# Altium project AMC_FMC_Carrier v4.PrjPcb (part 14 of 18)

## Sheet Clock_WR.SchDoc: AMC FMC Carrier v4
size 420 x 297 mm; CompanyName: WUT; Organization: WUT ISE; Address1: Warsaw Univeristy of Technology; Address2: Nowowiejska 15/19 00-665 Warsaw; Address3: t.przywozki@gmail.com; Revision: 1; SheetNumber: 23; SheetTotal: 29; Project: AMC FMC Carrier v4; ModifiedBy: -; CheckedDate: -; Title2: WR Clocks; DivGrp: ISE; Designer: T. Przywozki; ModifiedDate: -; ProjectName: ADC/DAC MEZZANINE
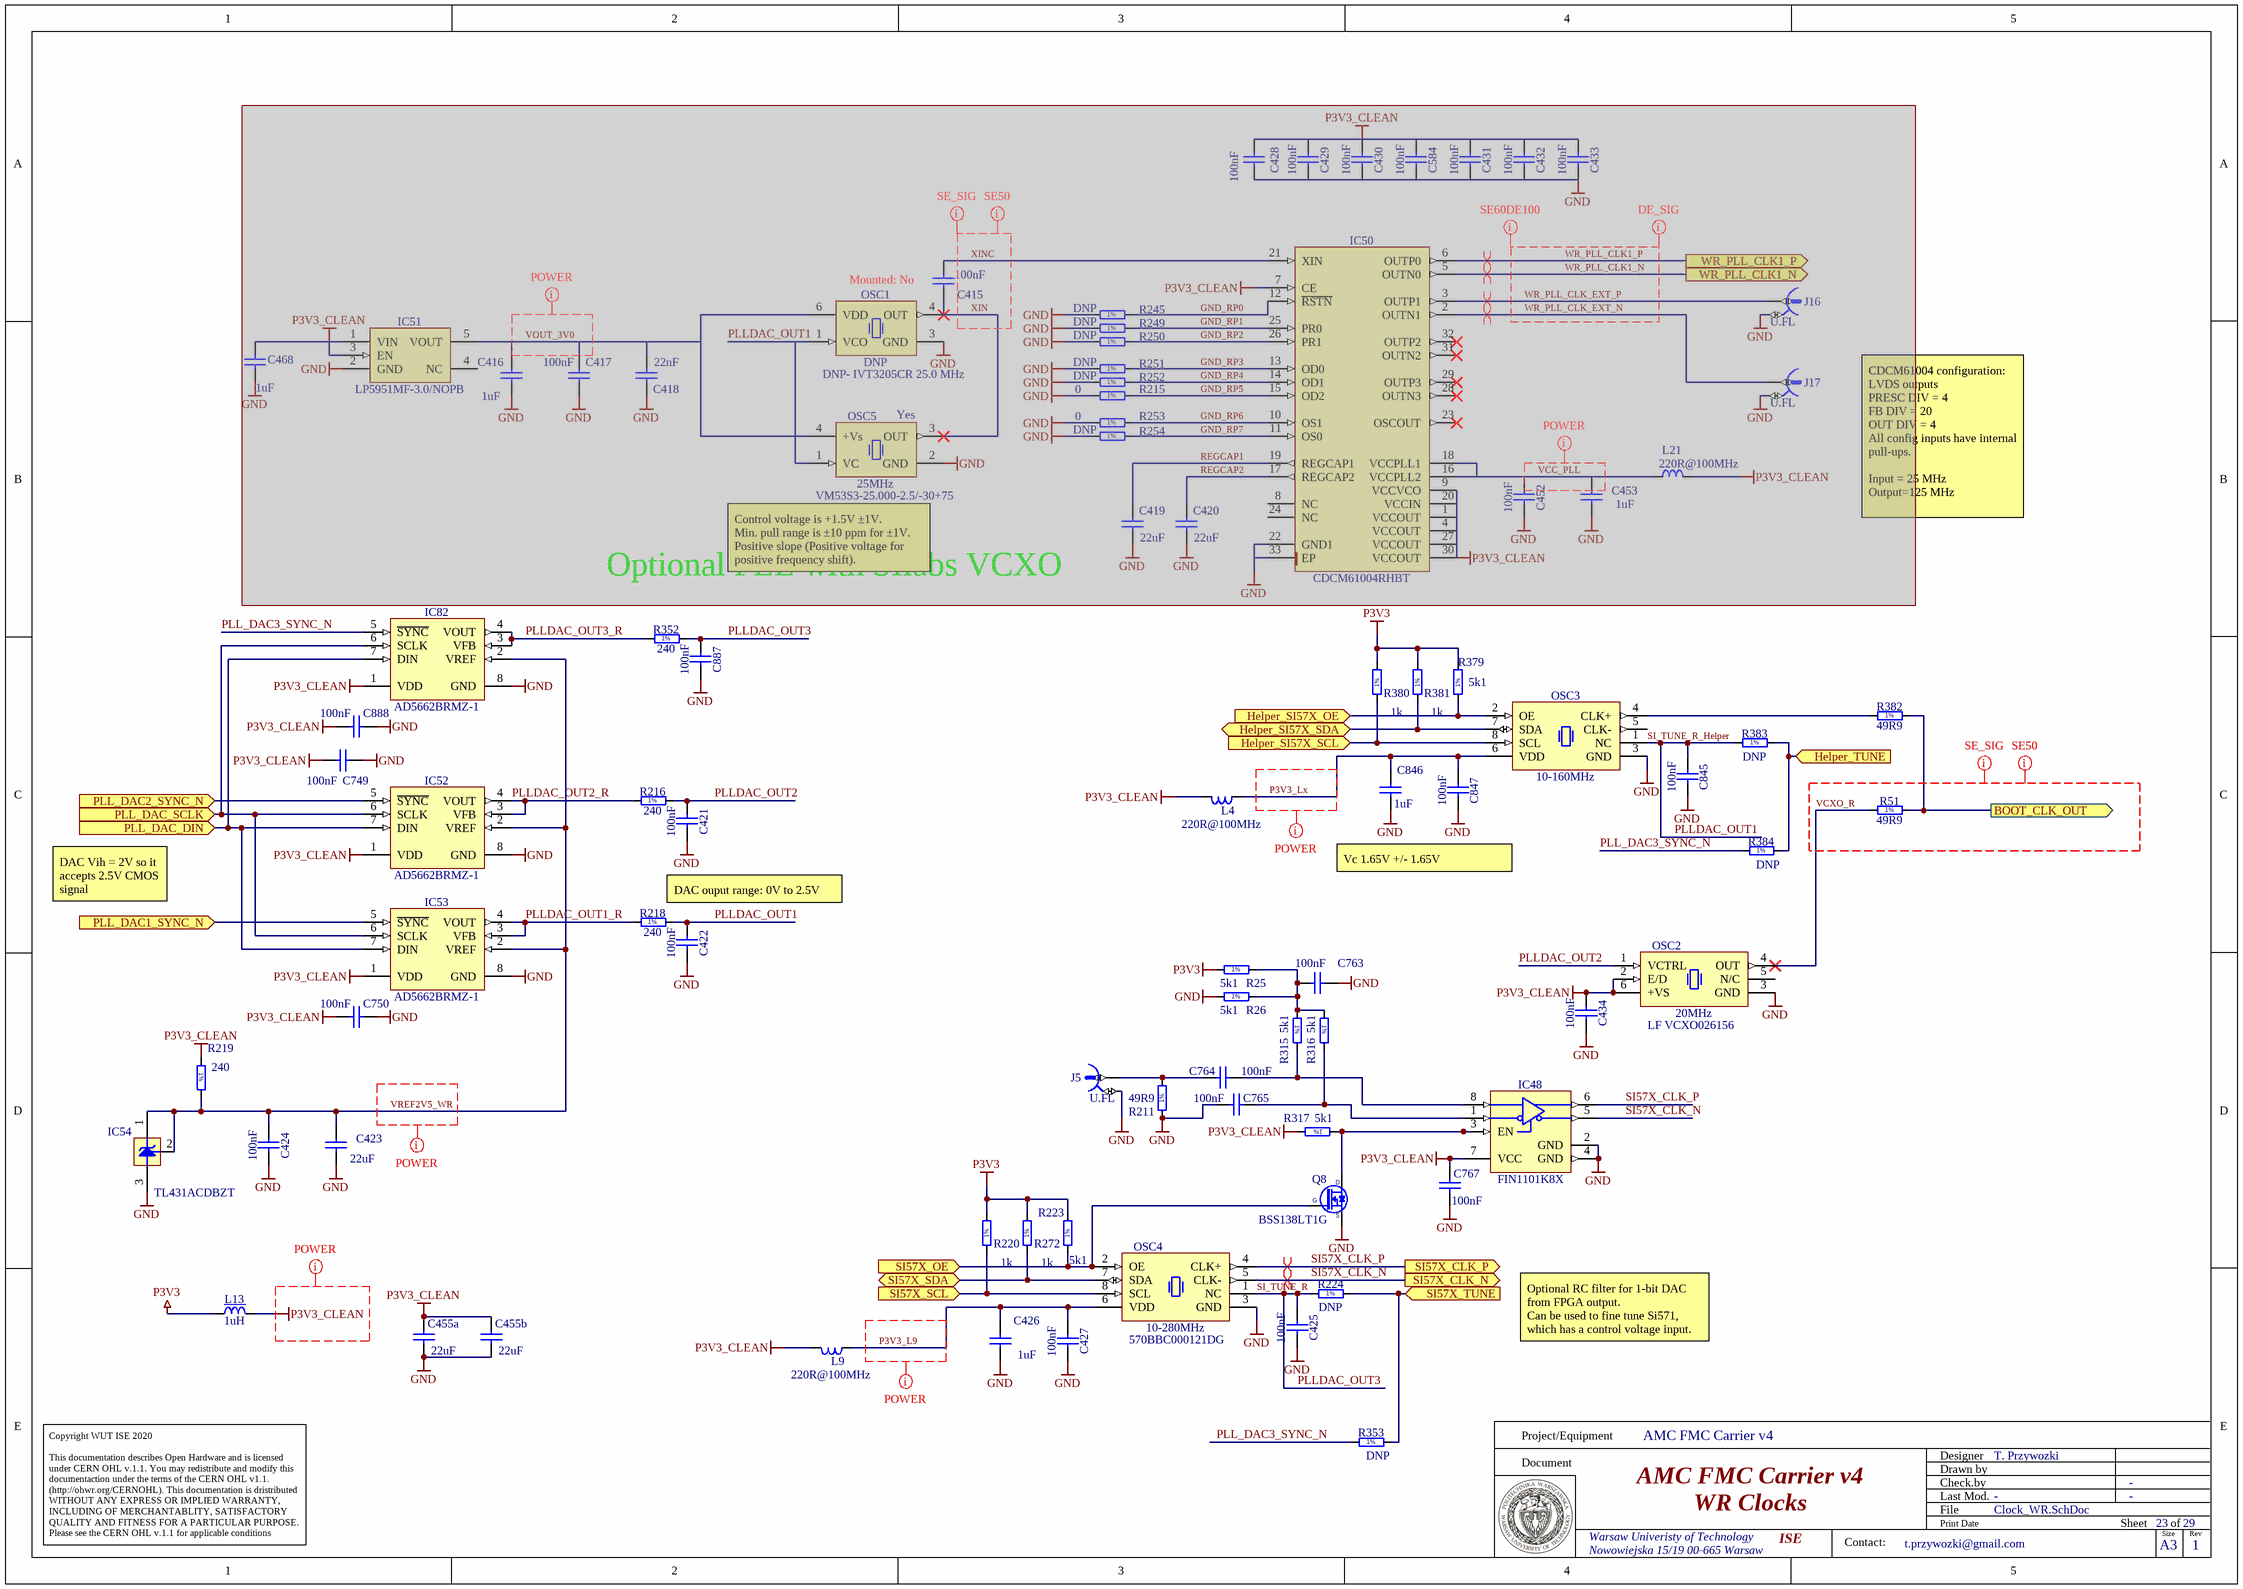
[diagram p24: Clock_WR.SchDoc]

### Parts
(Parts that share a designator on the sheet are numbered #1, #2 ... from top to bottom, then left to right.)
C415#2  100nF  [CAPC0603X33N]  (masked out: inside a compile mask, not in the netlist)
C416#2  1uF  [CAPC1608X87N]  (masked out: inside a compile mask, not in the netlist)
C417#2  100nF  [CAPC0603X33N]  (masked out: inside a compile mask, not in the netlist)
C418#2  22nF  [CAPC0603X33N]  (masked out: inside a compile mask, not in the netlist)
C419#2  22uF  [CAPC3216X180N]  (masked out: inside a compile mask, not in the netlist)
C420  22uF  [CAPC3216X180N]  (masked out: inside a compile mask, not in the netlist)
C421  100nF  [CAPC0603X33N]
C422  100nF  [CAPC0603X33N]
C423  22uF  [CAPC3216X180N]
C424  100nF  [CAPC0603X33N]
C425  100nF  [CAPC0603X33N]
C426  1uF  [CAPC1608X87N]
C427  100nF  [CAPC0603X33N]
C428  100nF  [CAPC0603X33N]  (masked out: inside a compile mask, not in the netlist)
C429  100nF  [CAPC0603X33N]  (masked out: inside a compile mask, not in the netlist)
C430  100nF  [CAPC0603X33N]  (masked out: inside a compile mask, not in the netlist)
C431  100nF  [CAPC0603X33N]  (masked out: inside a compile mask, not in the netlist)
C432  100nF  [CAPC0603X33N]  (masked out: inside a compile mask, not in the netlist)
C433#2  100nF  [CAPC0603X33N]  (masked out: inside a compile mask, not in the netlist)
C434  100nF  [CAPC0603X33N]
C452#2  100nF  [CAPC0603X33N]  (masked out: inside a compile mask, not in the netlist)
C453#1  1uF  [CAPC1608X87N]  (masked out: inside a compile mask, not in the netlist)
C455a  22uF  [CAPC3216X180N]
C455b  22uF  [CAPC3216X180N]
C468  1uF  [CAPC1608X87N]  (masked out: inside a compile mask, not in the netlist)
C584  100nF  [CAPC0603X33N]  (masked out: inside a compile mask, not in the netlist)
C749  100nF  [CAPC0603X33N]
C750  100nF  [CAPC0603X33N]
C763  100nF  [CAPC0603X33N]
C764  100nF  [CAPC0603X33N]
C765  100nF  [CAPC0603X33N]
C767  100nF  [CAPC0603X33N]
C845  100nF  [CAPC0603X33N]
C846  1uF  [CAPC1608X87N]
C847  100nF  [CAPC0603X33N]
C887  100nF  [CAPC0603X33N]
C888  100nF  [CAPC0603X33N]
IC48  FIN1101K8X  [SOP50P310X90-8N]
IC50#2  CDCM61004RHBT  [QFN50P500X500X100-33N-S355]  (masked out: inside a compile mask, not in the netlist)
IC51#2  LP5951MF-3.0/NOPB  [SOT95P284X122-5N]  (masked out: inside a compile mask, not in the netlist)
IC52  AD5662BRMZ-1  [SOP65P490X110-8N]
IC53  AD5662BRMZ-1  [SOP65P490X110-8N]
IC54  TL431ACDBZT  [SOT95P237X112-3N]
IC82  AD5662BRMZ-1  [SOP65P490X110-8N]
J5  U.FL  [HIROSE_U.FL-R-SMT-1(10)]
J16  U.FL  [HIROSE_U.FL-R-SMT-1(10)]  (masked out: inside a compile mask, not in the netlist)
J17  U.FL  [HIROSE_U.FL-R-SMT-1(10)]  (masked out: inside a compile mask, not in the netlist)
L4  220R@100MHz  [INDC2012X105N]
L9  220R@100MHz  [INDC2012X105N]
L13  1uH  [IND_PANASONIC_ELLVGG]
L21  220R@100MHz  [INDC2012X105N]  (masked out: inside a compile mask, not in the netlist)
OSC1  DNP  Manufacturer Part Number: DNP- IVT3205CR 25.0 MHz  Mounted: No  [OSC_RAKON_IVT3200C]  (masked out: inside a compile mask, not in the netlist)
OSC2  20MHz  Manufacturer Part Number: LF VCXO026156  [OSC_IQD_CFPV-45]
OSC3  10-160MHz  [OSC_SILICON-LAB_SI570]
OSC4  10-280MHz  Manufacturer Part Number: 570BBC000121DG  [OSC_SILICON-LAB_SI570]
OSC5  25MHz  Manufacturer Part Number: VM53S3-25.000-2.5/-30+75  Mounted: Yes  [OSCCC320X500X160-4N]  (masked out: inside a compile mask, not in the netlist)
Q8  BSS138LT1G  [SOT95P240X110-3N]
R25  5k1  [RESC1608X55N]
R26  5k1  [RESC1608X55N]
R51  49R9  [RESC1005X40N]
R211  49R9  [RESC1005X40N]
R215#2  0  [RESC1005X40N]  (masked out: inside a compile mask, not in the netlist)
R216  240  [RESC1005X40N]
R218  240  [RESC1005X40N]
R219  240  [RESC1005X40N]
R220  1k  [RESC1005X40N]
R223  5k1  [RESC1608X55N]
R224  DNP  [RESC1005X40N]
R245#2  DNP  [RESC1005X40N]  (masked out: inside a compile mask, not in the netlist)
R249#2  DNP  [RESC1005X40N]  (masked out: inside a compile mask, not in the netlist)
R250#2  DNP  [RESC1005X40N]  (masked out: inside a compile mask, not in the netlist)
R251#2  DNP  [RESC1005X40N]  (masked out: inside a compile mask, not in the netlist)
R252#2  DNP  [RESC1005X40N]  (masked out: inside a compile mask, not in the netlist)
R253#2  0  [RESC1005X40N]  (masked out: inside a compile mask, not in the netlist)
R254#2  DNP  [RESC1005X40N]  (masked out: inside a compile mask, not in the netlist)
R272  1k  [RESC1005X40N]
R315  5k1  [RESC1608X55N]
R316  5k1  [RESC1608X55N]
R317  5k1  [RESC1608X55N]
R352  240  [RESC1005X40N]
R353  DNP  [RESC1005X40N]
R379  5k1  [RESC1608X55N]
R380  1k  [RESC1005X40N]
R381  1k  [RESC1005X40N]
R382  49R9  [RESC1005X40N]
R383  DNP  [RESC1005X40N]
R384  DNP  [RESC1005X40N]

### Ports
BOOT_CLK_OUT (out), Helper_SI57X_OE (in), Helper_SI57X_SCL (in), Helper_SI57X_SDA (bidir), Helper_TUNE (in), PLL_DAC1_SYNC_N (in), PLL_DAC2_SYNC_N (in), PLL_DAC_DIN (in), PLL_DAC_SCLK (in), SI57X_CLK_N (out), SI57X_CLK_P (out), SI57X_OE (in), SI57X_SCL (in), SI57X_SDA (bidir), SI57X_TUNE (in), WR_PLL_CLK1_N (out), WR_PLL_CLK1_P (out)

### Nets
GND: C421.2 C422.2 C423.1 C424.2 C425.2 C426.1 C427.2 C434.2 C455a.1 C455b.1 C749.2 C750.2 C763.2 C765.1 C767.2 C845.2 C846.1 C847.2 C887.2 C888.2 IC48.2(GND) IC48.4(GND) IC52.8(GND) IC53.8(GND) IC54.3(A) IC82.8(GND) J5.2 OSC2.3(GND) OSC3.3(GND) OSC4.3(GND) Q8.2(S) R26.1 R211.1
P3V3: L13.1 R25.1 R220.2 R223.2 R272.2 R379.2 R380.2 R381.2
P3V3_CLEAN: C434.1 C455a.2 C455b.2 C749.1 C750.1 C767.1 C888.1 IC48.7(VCC) IC52.1(VDD) IC53.1(VDD) IC82.1(VDD) L4.2 L9.2 L13.2 OSC2.2(E/D) OSC2.6(+VS) R219.1 R317.2
FPGA_CLK.BOOT_CLK_IN: R51.2 R382.2 ; port BOOT_CLK_OUT
Helper_OE: OSC3.2(OE) R379.1 ; port Helper_SI57X_OE
Helper_SI57X_SCL: OSC3.8(SCL) R380.1 ; port Helper_SI57X_SCL
Helper_SI57X_SDA: OSC3.7(SDA) R381.1 ; port Helper_SI57X_SDA
Helper_TUNE: R383.2 R384.2 ; port Helper_TUNE
P3V3_L9: C426.2 C427.1 L9.1 OSC4.6(VDD)
P3V3_Lx: C846.2 C847.1 L4.1 OSC3.6(VDD)
PLL_DAC1_SYNC_N: IC53.5(~{SYNC}) ; port PLL_DAC1_SYNC_N
PLL_DAC2_SYNC_N: IC52.5(~{SYNC}) ; port PLL_DAC2_SYNC_N
PLL_DAC3_SYNC_N: IC82.5(~{SYNC}) R353.1 R384.1
PLL_DAC_DIN: IC52.7(DIN) IC53.7(DIN) IC82.7(DIN) ; port PLL_DAC_DIN
PLL_DAC_SCLK: IC52.6(SCLK) IC53.6(SCLK) IC82.6(SCLK) ; port PLL_DAC_SCLK
PLLDAC_OUT1: C422.1 C845.1 OSC3.1(NC) R218.2 R383.1  [also labelled SI_TUNE_R_Helper]
PLLDAC_OUT1_R: IC53.3(VFB) IC53.4(VOUT) R218.1
PLLDAC_OUT2: C421.1 OSC2.1(VCTRL) R216.2
PLLDAC_OUT2_R: IC52.3(VFB) IC52.4(VOUT) R216.1
PLLDAC_OUT3: C425.1 C887.1 OSC4.1(NC) R224.1 R352.2  [also labelled SI_TUNE_R]
PLLDAC_OUT3_R: IC82.3(VFB) IC82.4(VOUT) R352.1
SI57X_CLK_N: IC48.5(DOUT-) OSC4.5(CLK-) ; port SI57X_CLK_N  [project net SYNC_CLK_C_N]
SI57X_CLK_P: IC48.6(DOUT+) OSC4.4(CLK+) ; port SI57X_CLK_P  [project net SYNC_CLK_C_P]
SI57X_OE: OSC4.2(OE) Q8.1(G) R223.1 ; port SI57X_OE
SI57X_SCL: OSC4.8(SCL) R220.1 ; port SI57X_SCL
SI57X_SDA: OSC4.7(SDA) R272.1 ; port SI57X_SDA
SI57X_TUNE: R224.2 R353.2 ; port SI57X_TUNE
VCXO_R: OSC2.4(OUT) R51.1
VREF2V5_WR: C423.2 C424.1 IC52.2(VREF) IC53.2(VREF) IC54.1(C) IC54.2(Adj) IC82.2(VREF) R219.2
NetC763_1: C763.1 R25.2 R26.2 R315.1 R316.1
NetC764_1: C764.1 IC48.8(RIN+) R315.2
NetC764_2: C764.2 J5.1 R211.2
NetC765_2: C765.2 IC48.1(RIN-) R316.2
NetIC48_3: IC48.3(EN) Q8.3(D) R317.1
NetOSC3_4: OSC3.4(CLK+) R382.1

Not connected (* = marked no-connect by the designer): OSC2 5(N/C); OSC3 5(CLK-)

### Layout directives
differential pair: (no net found under the mark), SYNC_CLK_C_N, SYNC_CLK_C_P
net class DE_SIG: VCXO_R, WR_PLL_CLK1_N, WR_PLL_CLK1_P, WR_PLL_CLK_EXT_N, WR_PLL_CLK_EXT_P, XIN, XINC
net class SE50: VCXO_R, XIN, XINC
net class POWER: P3V3_CLEAN, P3V3_L9, P3V3_Lx, VCC_PLL, VOUT_3V0, VREF2V5_WR
net class SE60DE100: WR_PLL_CLK1_N, WR_PLL_CLK1_P, WR_PLL_CLK_EXT_N, WR_PLL_CLK_EXT_P

### Notes on the sheet
- CDCM61004 configuration:
  LVDS outputs
  PRESC DIV = 4
  FB DIV = 20
  OUT DIV = 4
  All config inputs have internal pull-ups.
  Input = 25 MHz
  Output=125 MHz
- Optional PLL with SIlabs VCXO
- (near OSC5) Control voltage is +1.5V ±1V.
  Min. pull range is ±10 ppm for ±1V.
  Positive slope (Positive voltage for positive frequency shift).
- Vc 1.65V +/- 1.65V
- DAC Vih = 2V so it accepts 2.5V CMOS signal
- DAC ouput range: 0V to 2.5V
- Optional RC filter for 1-bit DAC from FPGA output.
  Can be used to fine tune Si571, which has a control voltage input.
- Project/Equipment
- Document
- Designer
- Drawn by
- Check.by
- Copyright WUT ISE 2020
  This documentation describes Open Hardware and is licensed under CERN OHL v.1.1. You may redistribute and modify this documentaction under the terms of the CERN OHL v1.1.
  (http://ohwr.org/CERNOHL). This documentation is dristributed WITHOUT ANY EXPRESS OR IMPLIED WARRANTY, INCLUDING OF MERCHANTABLITY, SATISFACTORY QUALITY AND FITNESS FOR A PARTICULAR PURPOSE. Please see the CERN OHL v.1.1 for applicable conditions
- File
- Last Mod.
- Print Date
- Sheet
- Size
- A3
- of
- Rev
- Contact:
- (in symbol R0402_0R_JUMPER) 1%
- (in symbol R0402_1K_1%_0.0625W_100PPM) 1%
- (in symbol R0402_49R9_1%_0.0625W_100PPM) 1%
- (in symbol R0402_100R_1%_0.0625W_100PPM) 1%
- (in symbol R0402_240R_1%_0.0625W_100PPM) 1%
- (in symbol R0603_5K1_1%_0.1W_100PPM) 1%

### Library data of the parts
C415#2 C417#2 C421 C422 C424 C425 C427-C432 C433#2 C434 C452#2 C584 C749 C750 C763-C765 C767 C845 C847 C887 C888 = CC0201_100NF_6.3V_10%_X5R: as C128 on sheet Clock_management; Part Number: CC0201_100NF_6.3V_10%_X5R; Component Kind: Standard; Component Type: Standard; Pin Count: 2; Value: 100nF; Status: Not Recommended; Manufacturer Part Number: CC0201_100NF_6.3V_10%_X5R; Case: 0201; Mounted: Yes; Socket: No; SMD: Yes; Manufacturer1 Example: AVX; Manufacturer1 ComponentHeight: 0.33mm; HelpURL: \\cern.ch\dfs\Applications\Altium\Datasheets\CC0201_X5R_AVX.pdf; Author: CERN DEM JLC; CreateDate: 2007-12-03; LatestRevisionDate: 2007-12-03
C416#2 C426 C468 C846 = CC0603_1UF_16V_10%_X7R: Non-polarised capacitor; Part Description: SMD Multilayer Chip Ceramic Capacitor; Manufacturer: GENERIC; Manufacturer1 Part Number: 223824613663; Voltage: 16V; TC: X7R; Tolerance: ±10%; Table: Capacitors SMD; Part Number: CC0603_1UF_16V_10%_X7R; Component Kind: Standard; Component Type: Standard; Pin Count: 2; Value: 1uF; Status: Preferred; Manufacturer Part Number: CC0603_1uF_16V_10%_X7R; Case: 0603; Mounted: Yes; Socket: No; SMD: Yes; Manufacturer1 Example: PHYCOMP; Manufacturer1 ComponentHeight: 0.87mm; HelpURL: \\cern.ch\dfs\Applications\Altium\Datasheets\CC0805_X5R_PHYCOMP_HC.pdf; Author: CERN DEM JLC; CreateDate: 03/12/2007; LatestRevisionDate: 03/12/2007
C418#2 = CC0201_22NF_6.3V_10%_X5R: Non-polarised capacitor; Part Description: SMD Multilayer Chip Ceramic Capacitor; Manufacturer: GENERIC; Manufacturer1 Part Number: 02016D223KAT2A; Voltage: 6.3V; TC: X5R; Tolerance: ±10%; Table: Capacitors SMD; Part Number: CC0201_22NF_6.3V_10%_X5R; Component Kind: Standard; Component Type: Standard; Pin Count: 2; Value: 22nF; Status: Not Recommended; Manufacturer Part Number: CC0201_22NF_6.3V_10%_X5R; Case: 0201; Mounted: Yes; Socket: No; SMD: Yes; Manufacturer1 Example: AVX; Manufacturer1 ComponentHeight: 0.33mm; HelpURL: \\cern.ch\dfs\Applications\Altium\Datasheets\CC0201_X5R_AVX.pdf; Author: CERN DEM JLC; CreateDate: 2007-12-03; LatestRevisionDate: 2007-12-03
C419#2 C420 C423 C455a C455b = CC1206_22UF_10V_10%_X7R: as C454 on sheet Clock_management; Part Number: CC1206_22UF_10V_10%_X7R; Component Kind: Standard; Component Type: Standard; Pin Count: 2; Value: 22uF; Status: Preferred; Manufacturer Part Number: CC1206_22UF_10V_10%_X7R; Case: 1206; Mounted: Yes; Socket: No; SMD: Yes; Manufacturer1 Example: MURATA; Manufacturer1 ComponentHeight: 1.8mm; HelpURL: \\cern.ch\dfs\Applications\Altium\Datasheets\CC1206_X7R_MURATA_GRM-HI-CAP.pdf; Author: CERN DEM JLC; CreateDate: 2010-06-08; LatestRevisionDate: 2010-06-08
C453#1 = CC0603_1UF_16V_10%_X7R: Non-polarised capacitor; Part Description: SMD Multilayer Chip Ceramic Capacitor; Manufacturer: GENERIC; Manufacturer1 Part Number: 223824613663; Manufacturer1 Datasheet: \\cern.ch\dfs\Applications\Altium\Datasheets\CC0805_X5R_PHYCOMP_HC.pdf; Voltage: 16V; TC: X7R; Tolerance: ±10%; Table: Capacitors SMD; Part Number: CC0603_1UF_16V_10%_X7R; Component Kind: Standard; Component Type: Standard; Designator: Capacitor - non polarized; Library Reference: Capacitor - non polarized; Pin Count: 2; Value: 1uF; Status: Preferred; Manufacturer Part Number: CC0603_1uF_16V_10%_X7R; Case: 0603; Mounted: Yes; Socket: No; SMD: Yes; Manufacturer1 Example: PHYCOMP; Manufacturer1 ComponentHeight: 0.87mm; HelpURL: \\cern.ch\dfs\Applications\Altium\Datasheets\CC0805_X5R_PHYCOMP_HC.pdf; Author: CERN DEM JLC; CreateDate: 03/12/2007; LatestRevisionDate: 03/12/2007
IC48 = FIN1101K8X: LVDS Single Port High Speed Repeater; Manufacturer: FAIRCHILD SEMICONDUCTOR; PressFit: No; Bonding: No; Part Number: FIN1101K8X; Component Kind: Standard; Component Type: Standard; Device: FIN1101K8X; PackageDescription: SOP, 0.50mm Pitch; 8 pin, 2.30mm W X 2.00mm L X 0.90mm H body, PC Medium Density; Part Description: LVDS Single Port High Speed Repeater; Manufacturer Part Number: FIN1101K8X; Pin Count: 8; Case: TSSOP8; Mounted: Yes; Socket: No; SMD: Yes; Sense: No; ComponentHeight: 0.8mm; Author: CERN DEM JLC; HelpURL: \\cern.ch\dfs\Applications\Altium\Datasheets\FIN1101K8X.pdf; CreateDate: 08.11.2016; LatestRevisionDate: 08.11.2016
IC50#2 = CDCM61004RHBT: Four Output, Integrated VCO, Low-Jitter Clock Generator; Manufacturer: TEXAS INSTRUMENTS; Table: Analog & Interface; Part Number: CDCM61004RHBT; Component Kind: Standard; Component Type: Standard; Device: CDCM61004RHBT; PackageDescription: QFN, (MO-220-VHHD-4) 0.50mm pitch,square; 8 pin X 8 pin, 5mm X 5mm X 1.00mm H body (w/thermal tab 3.5 X 3.5mm),  IPC Medium Density; Part Description: Four Output, Integrated VCO, Low-Jitter Clock Generator; Manufacturer Part Number: CDCM61004RHBT; Pin Count: 33; Case: QFN32; Mounted: Yes; Socket: No; SMD: Yes; ComponentHeight: 1mm; Author: CERN DEM JLC; HelpURL: \\cern.ch\dfs\Applications\Altium\Datasheets\CDCM61004RHBT.pdf; CreateDate: 2010-08-25; LatestRevisionDate: 2010-08-25
IC51#2 = LP5951MF-3.0/NOPB: 150mA Micropower Low-Dropout CMOS Voltage Regulator; Part Description: 3V,  150mA Micropower Low-Dropout CMOS Voltage Regulator; Manufacturer: NATIONAL SEMICONDUCTOR; Table: Regulators; Part Number: LP5951MF-3.0/NOPB; Component Kind: Standard; Component Type: Standard; Device: LP5951MF-3.0/NOPB; PackageDescription: SOT23 5, Pitch 0.95mm - Body 1.67x2.99mm, IPC Medium Density; Manufacturer Part Number: LP5951MF-3.0/NOPB; Pin Count: 5; Case: SOT23-5; Mounted: Yes; Socket: No; SMD: Yes; ComponentHeight: 1.19mm; HelpURL: \\cern.ch\dfs\Applications\Altium\Datasheets\LP5951MF-3.0-NOPB.pdf; Author: CERN DEM JLC; CreateDate: 24/01/2011; LatestRevisionDate: 24/01/2011
IC52 IC53 IC82 = AD5662BRMZ-1: 2.7V to 5.5V, 250uA, Rail-to-Rail Output 16-Bit nanoDAC; Manufacturer: ANALOG DEVICES; Table: Analog & Interface; Part Number: AD5662BRMZ-1; Component Kind: Standard; Component Type: Standard; Device: AD5662BRMZ-1; PackageDescription: SOP, 8-Leads, Body 3.0x3.0mm, Pitch 0.65mm, IPC Medium Density; Part Description: 2.7V to 5.5V, 250uA, Rail-to-Rail Output 16-Bit nanoDAC; Manufacturer Part Number: AD5662BRMZ-1; Pin Count: 8; Case: MSOP8; Mounted: Yes; Socket: No; SMD: Yes; ComponentHeight: 1.1mm; Author: CERN DEM JLC; HelpURL: \\cern.ch\dfs\Applications\Altium\Datasheets\AD5662BRMZ-1.pdf; CreateDate: 1/10/2011; LatestRevisionDate: 1/10/2011
IC54 = TL431ACDBZT: Precision Reference 1=Cathode 2=Adj 3=Anode; Part Description: Vref (2.5V) To 36V 1% Precision Programmable Reference; Manufacturer: TEXAS INSTRUMENTS; PressFit: No; Bonding: No; Part Number: TL431ACDBZT; Component Kind: Standard; Component Type: Standard; Device: TL431ACDBZT; PackageDescription: SOT, 0.95mm, Pitch; 3 pin,1.30mm W X 2.92mm L X 1.12mm H Body, IPC Medium Density; Manufacturer Part Number: TL431ACDBZT; Pin Count: 3; Case: SOT23; Mounted: Yes; Socket: No; SMD: Yes; Sense: No; ComponentHeight: 1.12mm; HelpURL: \\cern.ch\dfs\Applications\Altium\Datasheets\TL431ACDBZT.pdf; Author: CERN DEM JLC; CreateDate: 28.02.2011; LatestRevisionDate: 28.02.2011
J5 J16 J17 = HIROSE_U.FL-R-SMT-1(10): as J7 on sheet Clock_management; Part Number: HIROSE_U.FL-R-SMT-1(10); Component Kind: Standard; Component Type: Standard; Pin Count: 2; Family: U.FL; Mounted: Yes; Socket: No; SMD: Yes; Sense: No; Status: None; Manufacturer Part Number: U.FL-R-SMT-1(10); ComponentHeight: 1.25mm; HelpURL: \\cern.ch\dfs\Applications\Altium\Datasheets\HIROSE_U.FL-R-SMT-1(10).pdf; Author: CERN DEM JLC; CreateDate: 24.03.2010; LatestRevisionDate: 24.03.2010
L4 L9 L21 = IND0805_MURATA_BLM21PG221SN1D: Inductor; Part Description: SMD EMIFIL Suppression Chip Bead Ferrite; Manufacturer: MURATA; Power: 2A; Resistance: 0.05R; Tolerance: ±25%; Table: Inductors SMD; Part Number: IND0805_MURATA_BLM21PG221SN1D; Component Kind: Standard; Component Type: Standard; Pin Count: 2; Value: 220R@100MHz; Status: None; Manufacturer Part Number: BLM21PG221SN1D; Case: 0805; Mounted: Yes; Socket: No; SMD: Yes; ComponentHeight: 1.05mm; HelpURL: \\cern.ch\dfs\Applications\Altium\Datasheets\IND0402_MURATA_BLM21P.pdf; Author: CERN DEM JLC; CreateDate: 25/01/2010; LatestRevisionDate: 25/01/2010
L13 = IND_1UH_30%_PANASONIC_ELLVGG1R0N: as L11 on sheet Clock_management; Part Number: IND_1UH_30%_PANASONIC_ELLVGG1R0N; Component Kind: Standard; Component Type: Standard; Pin Count: 2; Value: 1uH; Status: None; Manufacturer: PANASONIC; Manufacturer Part Number: ELLVGG1R0N; Mounted: Yes; Socket: No; SMD: Yes; Sense: No; ComponentHeight: 1.5mm; HelpURL: \\cern.ch\dfs\Applications\Altium\Datasheets\IND_PANASONIC_ELLVGG.pdf; Author: CERN DEM JLC; CreateDate: 09.11.2016; LatestRevisionDate: 09.11.2016
OSC1 = OSC_25MHZ_RAKON_IVT3205CR: Oscillator 4 pins 1=VCO 3=GND 4=OUT 6=VDC; Part Description: 11pF 3.3V ±1ppm Surface Mount TCXO Voltage Controlled Oscillator (IT3200C Serie); Manufacturer: RAKON; Value: 25MHz; Table: Crystals & Oscillators; Part Number: OSC_25MHZ_RAKON_IVT3205CR; Component Kind: Standard; Component Type: Standard; PackageDescription: Oscillator IVT3200C Serie, corner concave; 4 pin, 2.50mm L X 3.2mm W X 1.1mm H; Pin Count: 4; Socket: No; SMD: Yes; ComponentHeight: 1.1mm; HelpURL: \\cern.ch\dfs\Applications\Altium\Datasheets\OSC_RAKON_IVT3200C.pdf; Author: CERN DEM JLC; CreateDate: 08/02/2010; LatestRevisionDate: 08/02/2010
OSC2 = OSC_20MHZ_IQD_LF VCXO026156: 3.3V ±100ppm 15pF HCMOS Tri-State Surface Mount Voltage Controlled Oscillator VCXO (CFPV-45 Serie); Manufacturer: IQD FREQUENCY PRODUCTS; Table: Crystals & Oscillators; Part Number: OSC_20MHZ_IQD_LF VCXO026156; Component Kind: Standard; Component Type: Standard; PackageDescription: SMD VCXO, side convave, 6 pins, 5.00x7.00mm (CFPV-45 Serie); Value: 20MHz; Part Description: 3.3V ±100ppm 15pF HCMOS Tri-State Surface Mount Voltage Controlled Oscillator VCXO (CFPV-45 Serie); Pin Count: 6; Mounted: Yes; Socket: No; SMD: Yes; ComponentHeight: 1.7mm; HelpURL: \\cern.ch\dfs\Applications\Altium\Datasheets\OSC_IQD_CFPV-45.pdf; Author: CERN DEM JLC; CreateDate: 1/24/2011; LatestRevisionDate: 1/24/2011
OSC3 = OSC_10-160MHZ_SILICON-LAB_Si570CAC000121DG: Any-Rate I2C Programmable XO Oscillator Si570 Serie; Part Description: 10-160MHz 3.3V ±50ppm CMOS Any-Rate I2C Programmable XO Oscillator Si570 Series; Manufacturer: SILICON LABS; PressFit: No; Bonding: No; Part Number: OSC_10-160MHZ_SILICON-LAB_Si570CAC000121DG; Component Kind: Standard; Component Type: Standard; PackageDescription: Oscillator Si570 Serie, 8 pins, 5x7mm; Value: 10-160MHz; Manufacturer Part Number: 570CAC000121DG; Pin Count: 8; Mounted: Yes; Socket: No; SMD: Yes; Sense: No; ComponentHeight: 1.8mm; HelpURL: \\cern.ch\dfs\Applications\Altium\Datasheets\OSC_SILICON-LAB_Si570.pdf; Author: CERN DEM JMW; CreateDate: 06.03.2015; LatestRevisionDate: 06.03.2015
OSC4 = OSC_10-280MHZ_SILICON-LAB_Si570BBC000121DG: Any-Rate I2C Programmable XO Oscillator Si570 Serie; Part Description: 10-280MHz 3.3V ±20ppm LVDS Any-Rate I2C Programmable XO Oscillator Si570 Serie; Manufacturer: SILICON LABS; Table: Crystals & Oscillators; Part Number: OSC_10-280MHZ_SILICON-LAB_Si570BBC000121DG; Component Kind: Standard; Component Type: Standard; PackageDescription: Oscillator Si570 Serie, 8 pins, 5x7mm; Value: 10-280MHz; Pin Count: 8; Mounted: Yes; Socket: No; SMD: Yes; ComponentHeight: 1.85mm; HelpURL: \\cern.ch\dfs\Applications\Altium\Datasheets\OSC_SILICON-LAB_SI570.pdf; Author: CERN DEM JLC; CreateDate: 2/9/2010; LatestRevisionDate: 2/9/2010
OSC5 = OSC_25MHZ_MERCURY_VM53S3-25.000-2.5/-30+75: Oscillator 4 pins 1=VC 2=GND 3=OUT 4=+Vs; Part Description: 3V ±2.5ppmVoltage Controlled Temperature Compensated Crystal Oscillator VM53S3 Serie; Manufacturer: MERCURY ELECTRONICS; Table: Crystals & Oscillators; Part Number: OSC_25MHZ_MERCURY_VM53S3-25.000-2.5/-30+75; Component Kind: Standard; Component Type: Standard; PackageDescription: SMD Oscillator, Corner Convave, 4 pins, 5x3.2mm; Value: 25MHz; Pin Count: 4; Socket: No; SMD: Yes; ComponentHeight: 1.6mm; HelpURL: \\cern.ch\dfs\Applications\Altium\Datasheets\OSC_MERCURY_VM53S3.pdf; Author: CERN DEM JLC; CreateDate: 1/20/2010; LatestRevisionDate: 1/24/2011
Q8 = BSS138LT1G: N-CHANNEL MOSFET WITH DIODE; Part Description: 50V 200mA N-Channel Enhancement Mode Field-Effect Transistor; Manufacturer: ON SEMICONDUCTOR; PressFit: No; Bonding: No; Part Number: BSS138LT1G; Component Kind: Standard; Component Type: Standard; Device: BSS138LT1G; PackageDescription: SOT23 3-Leads, Pitch 0.95mm - Body 1.4x3mm, IPC Medium Density; Manufacturer Part Number: BSS138LT1G; Pin Count: 3; Case: SOT23-3; Mounted: Yes; Socket: No; SMD: Yes; Sense: No; ComponentHeight: 1.11mm; HelpURL: \\cern.ch\dfs\Applications\Altium\Datasheets\BSS138LT1G.pdf; Author: CERN DEM JLC; CreateDate: 23.03.2009; LatestRevisionDate: 23.03.2009
R25 R26 R223 R315-R317 R379 = R0603_5K1_1%_0.1W_100PPM: Resistor - 1%; Part Description: General Purpose Thick Film Chip Resistor; Manufacturer: GENERIC; Manufacturer1 Part Number: NRC06F5101TRF; Power: 0.1W; TC: ±100ppm/°C; Table: Resistors SMD; Part Number: R0603_5K1_1%_0.1W_100PPM; Component Kind: Standard; Component Type: Standard; Pin Count: 2; Value: 5k1; Status: Preferred; Tolerance: ±1%; Manufacturer Part Number: R0603_5K1_1%_0.1W_100PPM; Case: 0603; Mounted: Yes; Socket: No; SMD: Yes; Manufacturer1 Example: NIC COMPONENT; Manufacturer1 ComponentHeight: 0.55mm; HelpURL: \\cern.ch\dfs\Applications\Altium\Datasheets\R0603_NIC_NRC.pdf; Author: CERN DEM JLC; CreateDate: 03/12/2007; LatestRevisionDate: 13/03/2008
R51 R211 R382 = R0402_49R9_1%_0.0625W_100PPM: Resistor - 1%; Part Description: General Purpose Thick Film Chip Resistor; Manufacturer: GENERIC; Manufacturer1 Part Number: 232270674999L or RC0402FR-0749R9L; TC: ±100ppm/°C; Table: Resistors SMD; Part Number: R0402_49R9_1%_0.0625W_100PPM; Component Kind: Standard; Component Type: Standard; Pin Count: 2; Value: 49R9; Status: Not recommended; Power: 0.0625W; Tolerance: ±1%; Manufacturer Part Number: R0402_49R9_1%_0.0625W_100PPM; Case: 0402; Mounted: Yes; Socket: No; SMD: Yes; Manufacturer1 Example: YAGEO PHYCOMP; Manufacturer1 ComponentHeight: 0.4mm; HelpURL: \\cern.ch\dfs\Applications\Altium\Datasheets\R0402_Phycomp_RC0402.pdf; Author: CERN DEM JLC; CreateDate: 2012-10-24; LatestRevisionDate: 2012-10-24
R215#2 R253#2 = R0402_0R_JUMPER: Resistor - 1%; Part Description: 1A (0.05R Max DC Resistance) Zero Ohm Jumper; Manufacturer: GENERIC; Manufacturer1 Part Number: 232270591001L; Table: Resistors SMD; Part Number: R0402_0R_JUMPER; Component Kind: Standard; Component Type: Standard; Pin Count: 2; Value: 0; Status: Not recommended; Manufacturer Part Number: R0402_0R_JUMPER; Case: 0402; Socket: No; SMD: Yes; Manufacturer1 Example: YAGEO PHYCOMP; Manufacturer1 ComponentHeight: 0.4mm; HelpURL: \\cern.ch\dfs\Applications\Altium\Datasheets\R0402_Phycomp_RC0402.pdf; Author: CERN DEM JLC; CreateDate: 2007-12-03; LatestRevisionDate: 2012-10-17; Mounted: Yes
R216 R218 R219 R352 = R0402_240R_1%_0.0625W_100PPM: Resistor - 1%; Part Description: General Purpose Thick Film Chip Resistor; Manufacturer: GENERIC; Manufacturer1 Part Number: 232270672401L; TC: ±100ppm/°C; Table: Resistors SMD; Part Number: R0402_240R_1%_0.0625W_100PPM; Component Kind: Standard; Component Type: Standard; Pin Count: 2; Value: 240; Status: Not recommended; Power: 0.0625W; Tolerance: ±1%; Manufacturer Part Number: R0402_240R_1%_0.0625W_100PPM; Case: 0402; Mounted: Yes; Socket: No; SMD: Yes; Manufacturer1 Example: YAGEO PHYCOMP; Manufacturer1 ComponentHeight: 0.4mm; HelpURL: \\cern.ch\dfs\Applications\Altium\Datasheets\R0402_Phycomp_RC0402.pdf; Author: CERN DEM JLC; CreateDate: 2007-12-03; LatestRevisionDate: 2012-10-17
R220 R272 R380 R381 = R0402_1K_1%_0.0625W_100PPM: Resistor - 1%; Part Description: General Purpose Thick Film Chip Resistor; Manufacturer: GENERIC; Manufacturer1 Part Number: 232270671002L; TC: ±100ppm/°C; Table: Resistors SMD; Part Number: R0402_1K_1%_0.0625W_100PPM; Component Kind: Standard; Component Type: Standard; Pin Count: 2; Value: 1k; Status: Not recommended; Power: 0.0625W; Tolerance: ±1%; Manufacturer Part Number: R0402_1K_1%_0.0625W_100PPM; Case: 0402; Mounted: Yes; Socket: No; SMD: Yes; Manufacturer1 Example: YAGEO PHYCOMP; Manufacturer1 ComponentHeight: 0.4mm; HelpURL: \\cern.ch\dfs\Applications\Altium\Datasheets\R0402_Phycomp_RC0402.pdf; Author: CERN DEM JLC; CreateDate: 2007-12-03; LatestRevisionDate: 2012-10-17
R224 R353 R383 R384 = R0402_100R_1%_0.0625W_100PPM: Resistor - 1%; Part Description: General Purpose Thick Film Chip Resistor; Manufacturer: GENERIC; Manufacturer1 Part Number: 232270671001L; Value: 100; TC: ±100ppm/°C; Table: Resistors SMD; Part Number: R0402_100R_1%_0.0625W_100PPM; Component Kind: Standard; Component Type: Standard; Pin Count: 2; Status: Not recommended; Power: 0.0625W; Tolerance: ±1%; Manufacturer Part Number: R0402_100R_1%_0.0625W_100PPM; Case: 0402; Mounted: Yes; Socket: No; SMD: Yes; Manufacturer1 Example: YAGEO PHYCOMP; Manufacturer1 ComponentHeight: 0.4mm; HelpURL: \\cern.ch\dfs\Applications\Altium\Datasheets\R0402_Phycomp_RC0402.pdf; Author: CERN DEM JLC; CreateDate: 2007-12-03; LatestRevisionDate: 2012-10-17
R245#2 R249#2 R250#2 R251#2 R252#2 R254#2 = R0402_0R_JUMPER: Resistor - 1%; Part Description: 1A (0.05R Max DC Resistance) Zero Ohm Jumper; Manufacturer: GENERIC; Manufacturer1 Part Number: 232270591001L; Value: 0; Table: Resistors SMD; Part Number: R0402_0R_JUMPER; Component Kind: Standard; Component Type: Standard; Pin Count: 2; Status: Not recommended; Manufacturer Part Number: R0402_0R_JUMPER; Case: 0402; Socket: No; SMD: Yes; Manufacturer1 Example: YAGEO PHYCOMP; Manufacturer1 ComponentHeight: 0.4mm; HelpURL: \\cern.ch\dfs\Applications\Altium\Datasheets\R0402_Phycomp_RC0402.pdf; Author: CERN DEM JLC; CreateDate: 2007-12-03; LatestRevisionDate: 2012-10-17; Mounted: Yes

## Sheet AMC-SATA.SchDoc: AMC FMC Carrier v4
size A4; CompanyName: WUT; Organization: WUT ISE; Address1: Warsaw Univeristy of Technology; Address2: Nowowiejska 15/19 00-665 Warsaw; Address3: t.przywozki@gmail.com; Revision: 1; SheetNumber: 25; SheetTotal: 29; Project: AMC FMC Carrier v4; ModifiedBy: -; CreateDate: XX/XX/XXXX; CheckedDate: -; Title2: AMC - SATA; DivGrp: ISE; Designer: T. Przywozki; ModifiedDate: -; ProjectName: ADC/DAC MEZZANINE
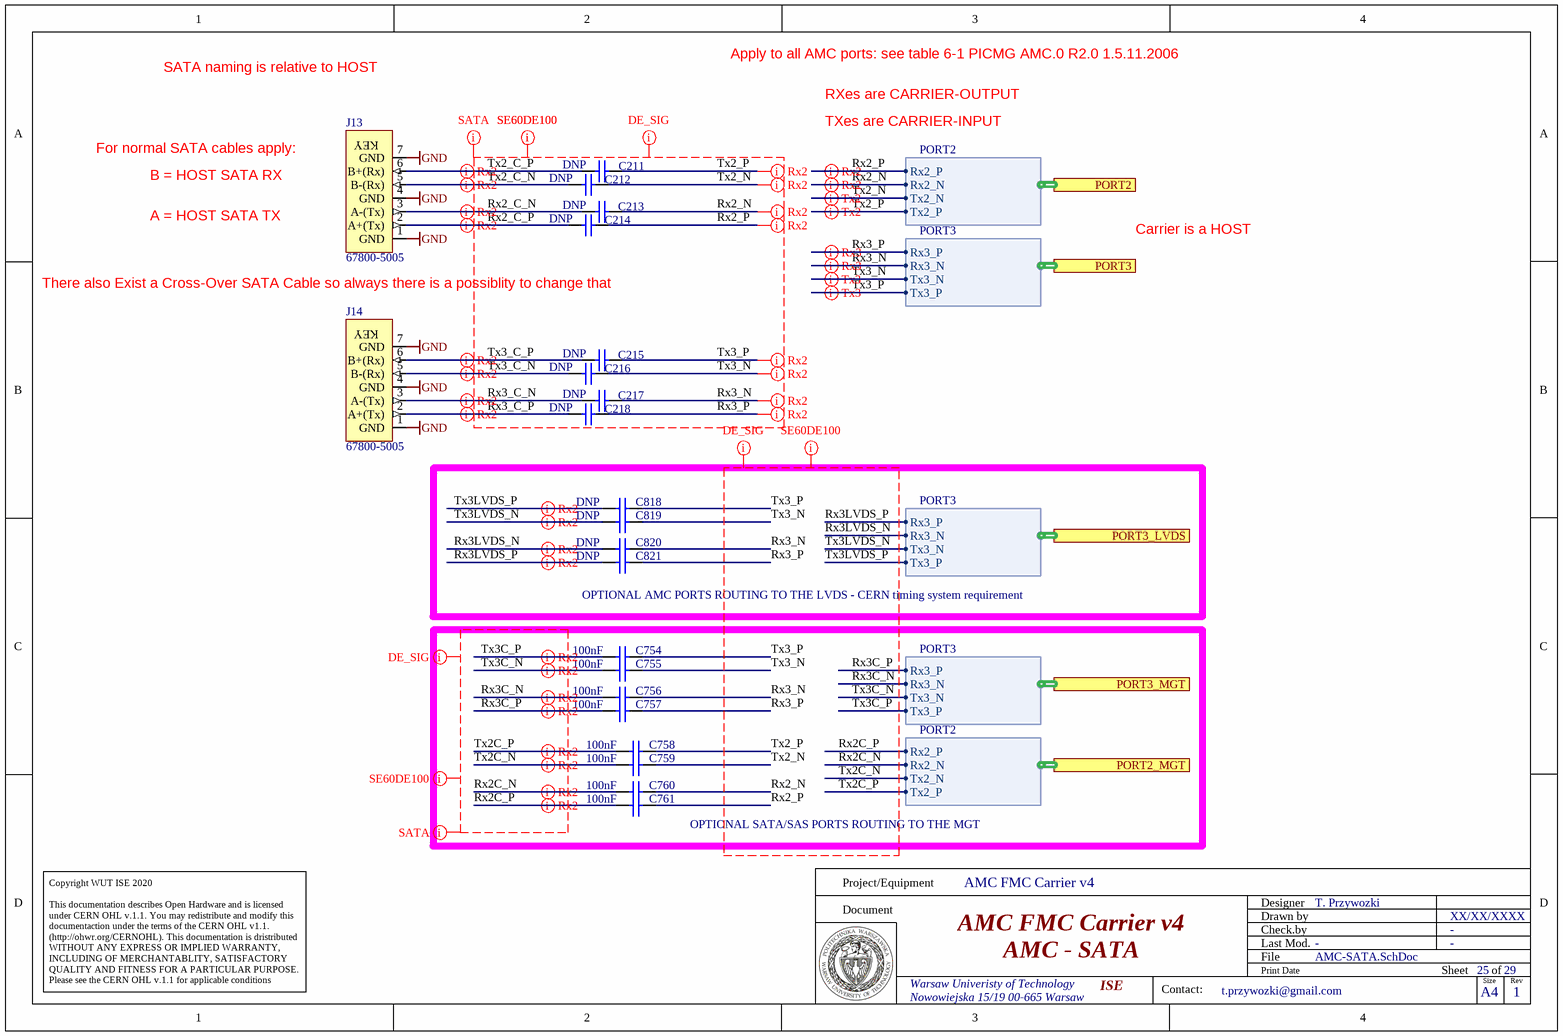
[diagram p25: AMC-SATA.SchDoc]

### Parts
C211  DNP  [CAPC0603X33N]
C212  DNP  [CAPC0603X33N]
C213  DNP  [CAPC0603X33N]
C214  DNP  [CAPC0603X33N]
C215  DNP  [CAPC0603X33N]
C216  DNP  [CAPC0603X33N]
C217  DNP  [CAPC0603X33N]
C218  DNP  [CAPC0603X33N]
C754  100nF  [CAPC0603X33N]
C755  100nF  [CAPC0603X33N]
C756  100nF  [CAPC0603X33N]
C757  100nF  [CAPC0603X33N]
C758  100nF  [CAPC0603X33N]
C759  100nF  [CAPC0603X33N]
C760  100nF  [CAPC0603X33N]
C761  100nF  [CAPC0603X33N]
C818  DNP  [CAPC0603X33N]
C819  DNP  [CAPC0603X33N]
C820  DNP  [CAPC0603X33N]
C821  DNP  [CAPC0603X33N]
J13  67800-5005  [CON_SATA_V]
J14  67800-5005  [CON_SATA_V]

### Blocks framed on the sheet
OPTIONAL SATA/SAS PORTS ROUTING TO THE MGT: C754-C761

### Ports
PORT2 (harness PORT2), PORT2_MGT (harness PORT2), PORT3 (harness PORT3), PORT3_LVDS (harness PORT3), PORT3_MGT (harness PORT3)

### Harnesses
PORT2: Rx2_P, Rx2_N, Tx2_N, Tx2_P
PORT3: Rx3_P, Rx3_N, Tx3_N, Tx3_P

### Nets
GND: J13.1(GND) J13.4(GND) J13.7(GND) J14.1(GND) J14.4(GND) J14.7(GND)
Rx2_C_N: C213.1 J13.3(A-(Tx))
Rx2_C_P: C214.1 J13.2(A+(Tx))
Rx2_N: C213.2 C760.2 ; port PORT2.Rx2_N  [project net PORT2.Rx2_N]
Rx2_P: C214.2 C761.2 ; port PORT2.Rx2_P  [project net PORT2.Rx2_P]
Rx2C_N: C760.1 ; port PORT2_MGT.Rx2_N
Rx2C_P: C761.1 ; port PORT2_MGT.Rx2_P
Rx3_C_N: C217.1 J14.3(A-(Tx))
Rx3_C_P: C218.1 J14.2(A+(Tx))
Rx3_N: C217.2 C756.2 C820.2 ; port PORT3.Rx3_N  [project net PORT3.Rx3_N]
Rx3_P: C218.2 C757.2 C821.2 ; port PORT3.Rx3_P  [project net PORT3.Rx3_P]
Rx3C_N: C756.1 ; port PORT3_MGT.Rx3_N
Rx3C_P: C757.1 ; port PORT3_MGT.Rx3_P
Rx3LVDS_N: C820.1 ; port PORT3_LVDS.Rx3_N
Rx3LVDS_P: C821.1 ; port PORT3_LVDS.Rx3_P
Tx2_C_N: C212.1 J13.5(B-(Rx))
Tx2_C_P: C211.1 J13.6(B+(Rx))
Tx2_N: C212.2 C759.2 ; port PORT2.Tx2_N  [project net PORT2.Tx2_N]
Tx2_P: C211.2 C758.2 ; port PORT2.Tx2_P  [project net PORT2.Tx2_P]
Tx2C_N: C759.1 ; port PORT2_MGT.Tx2_N
Tx2C_P: C758.1 ; port PORT2_MGT.Tx2_P
Tx3_C_N: C216.1 J14.5(B-(Rx))
Tx3_C_P: C215.1 J14.6(B+(Rx))
Tx3_N: C216.2 C755.2 C819.2 ; port PORT3.Tx3_N  [project net PORT3.Tx3_N]
Tx3_P: C215.2 C754.2 C818.2 ; port PORT3.Tx3_P  [project net PORT3.Tx3_P]
Tx3C_N: C755.1 ; port PORT3_MGT.Tx3_N
Tx3C_P: C754.1 ; port PORT3_MGT.Tx3_P
Tx3LVDS_N: C819.1 ; port PORT3_LVDS.Tx3_N
Tx3LVDS_P: C818.1 ; port PORT3_LVDS.Tx3_P

### Layout directives
differential pair: PORT2.Rx2_N, PORT2.Rx2_P, PORT2.Tx2_N, PORT2.Tx2_P, PORT3.Rx3_N, PORT3.Rx3_P, PORT3.Tx3_N, PORT3.Tx3_P, Rx2_C_N, Rx2_C_P, Rx2C_N, Rx2C_P, Rx3_C_N, Rx3_C_P, Rx3C_N, Rx3C_P, Rx3LVDS_N, Rx3LVDS_P, Tx2_C_N, Tx2_C_P, Tx2C_N, Tx2C_P, Tx3_C_N, Tx3_C_P, Tx3C_N, Tx3C_P, Tx3LVDS_N, Tx3LVDS_P
net class SATA: Rx2_C_N, Rx2_C_P, Rx2_N, Rx2_P, Rx2C_N, Rx2C_P, Rx3_C_N, Rx3_C_P, Rx3_N, Rx3_P, Rx3C_N, Rx3C_P, Tx2_C_N, Tx2_C_P, Tx2_N, Tx2_P, Tx2C_N, Tx2C_P, Tx3_C_N, Tx3_C_P, Tx3_N, Tx3_P, Tx3C_N, Tx3C_P
net class SE60DE100: Rx2_C_N, Rx2_C_P, Rx2_N, Rx2_P, Rx2C_N, Rx2C_P, Rx3_C_N, Rx3_C_P, Rx3_N, Rx3_P, Rx3C_N, Rx3C_P, Rx3LVDS_N, Rx3LVDS_P, Tx2_C_N, Tx2_C_P, Tx2_N, Tx2_P, Tx2C_N, Tx2C_P, Tx3_C_N, Tx3_C_P, Tx3_N, Tx3_P, Tx3C_N, Tx3C_P, Tx3LVDS_N, Tx3LVDS_P
net class DE_SIG: Rx2_C_N, Rx2_C_P, Rx2_N, Rx2_P, Rx2C_N, Rx2C_P, Rx3_C_N, Rx3_C_P, Rx3_N, Rx3_P, Rx3C_N, Rx3C_P, Rx3LVDS_N, Rx3LVDS_P, Tx2_C_N, Tx2_C_P, Tx2_N, Tx2_P, Tx2C_N, Tx2C_P, Tx3_C_N, Tx3_C_P, Tx3_N, Tx3_P, Tx3C_N, Tx3C_P, Tx3LVDS_N, Tx3LVDS_P
net class SE60DE101: Rx2_C_N, Rx2_C_P, Rx2_N, Rx2_P, Rx3_C_N, Rx3_C_P, Rx3_N, Rx3_P, Tx2_C_N, Tx2_C_P, Tx2_N, Tx2_P, Tx3_C_N, Tx3_C_P, Tx3_N, Tx3_P

### Notes on the sheet
- SATA naming is relative to HOST
- Apply to all AMC ports: see table 6-1 PICMG AMC.0 R2.0 1.5.11.2006
- RXes are CARRIER-OUTPUT
- For normal SATA cables apply:
- B = HOST SATA RX
- TXes are CARRIER-INPUT
- A = HOST SATA TX
- Carrier is a HOST
- There also Exist a Cross-Over SATA Cable so always there is a possiblity to change that
- OPTIONAL AMC PORTS ROUTING TO THE LVDS - CERN timing system requirement
- Project/Equipment
- Document
- Designer
- Drawn by
- Check.by
- Copyright WUT ISE 2020
  This documentation describes Open Hardware and is licensed under CERN OHL v.1.1. You may redistribute and modify this documentaction under the terms of the CERN OHL v1.1.
  (http://ohwr.org/CERNOHL). This documentation is dristributed WITHOUT ANY EXPRESS OR IMPLIED WARRANTY, INCLUDING OF MERCHANTABLITY, SATISFACTORY QUALITY AND FITNESS FOR A PARTICULAR PURPOSE. Please see the CERN OHL v.1.1 for applicable conditions
- File
- Last Mod.
- Print Date
- Sheet
- Size
- A4
- of
- Rev
- Contact:
- (in symbol CON_SATA_V) KEY

### Library data of the parts
C211-C218 C818-C821 = CC0201_100NF_6.3V_10%_X5R: Non-polarised capacitor; Part Description: SMD Multilayer Chip Ceramic Capacitor; Manufacturer: GENERIC; Manufacturer1 Part Number: 02016D104KAT2A; Value: 100nF; Voltage: 6.3V; TC: X5R; Tolerance: ±10%; Table: Capacitors SMD; Part Number: CC0201_100NF_6.3V_10%_X5R; Component Kind: Standard; Component Type: Standard; Pin Count: 2; Status: Not Recommended; Manufacturer Part Number: CC0201_100NF_6.3V_10%_X5R; Case: 0201; Mounted: Yes; Socket: No; SMD: Yes; Manufacturer1 Example: AVX; Manufacturer1 ComponentHeight: 0.33mm; HelpURL: \\cern.ch\dfs\Applications\Altium\Datasheets\CC0201_X5R_AVX.pdf; Author: CERN DEM JLC; CreateDate: 2007-12-03; LatestRevisionDate: 2007-12-03
C754-C761 = CC0201_100NF_6.3V_10%_X5R: as C128 on sheet Clock_management; Part Number: CC0201_100NF_6.3V_10%_X5R; Component Kind: Standard; Component Type: Standard; Pin Count: 2; Value: 100nF; Status: Not Recommended; Manufacturer Part Number: CC0201_100NF_6.3V_10%_X5R; Case: 0201; Mounted: Yes; Socket: No; SMD: Yes; Manufacturer1 Example: AVX; Manufacturer1 ComponentHeight: 0.33mm; HelpURL: \\cern.ch\dfs\Applications\Altium\Datasheets\CC0201_X5R_AVX.pdf; Author: CERN DEM JLC; CreateDate: 2007-12-03; LatestRevisionDate: 2007-12-03
J13 J14 = CON_SATA_V: SATA conenctor  PCB Molex